# Altium schematic sheet 08) SD card.SchDoc
size 447 x 332 mm
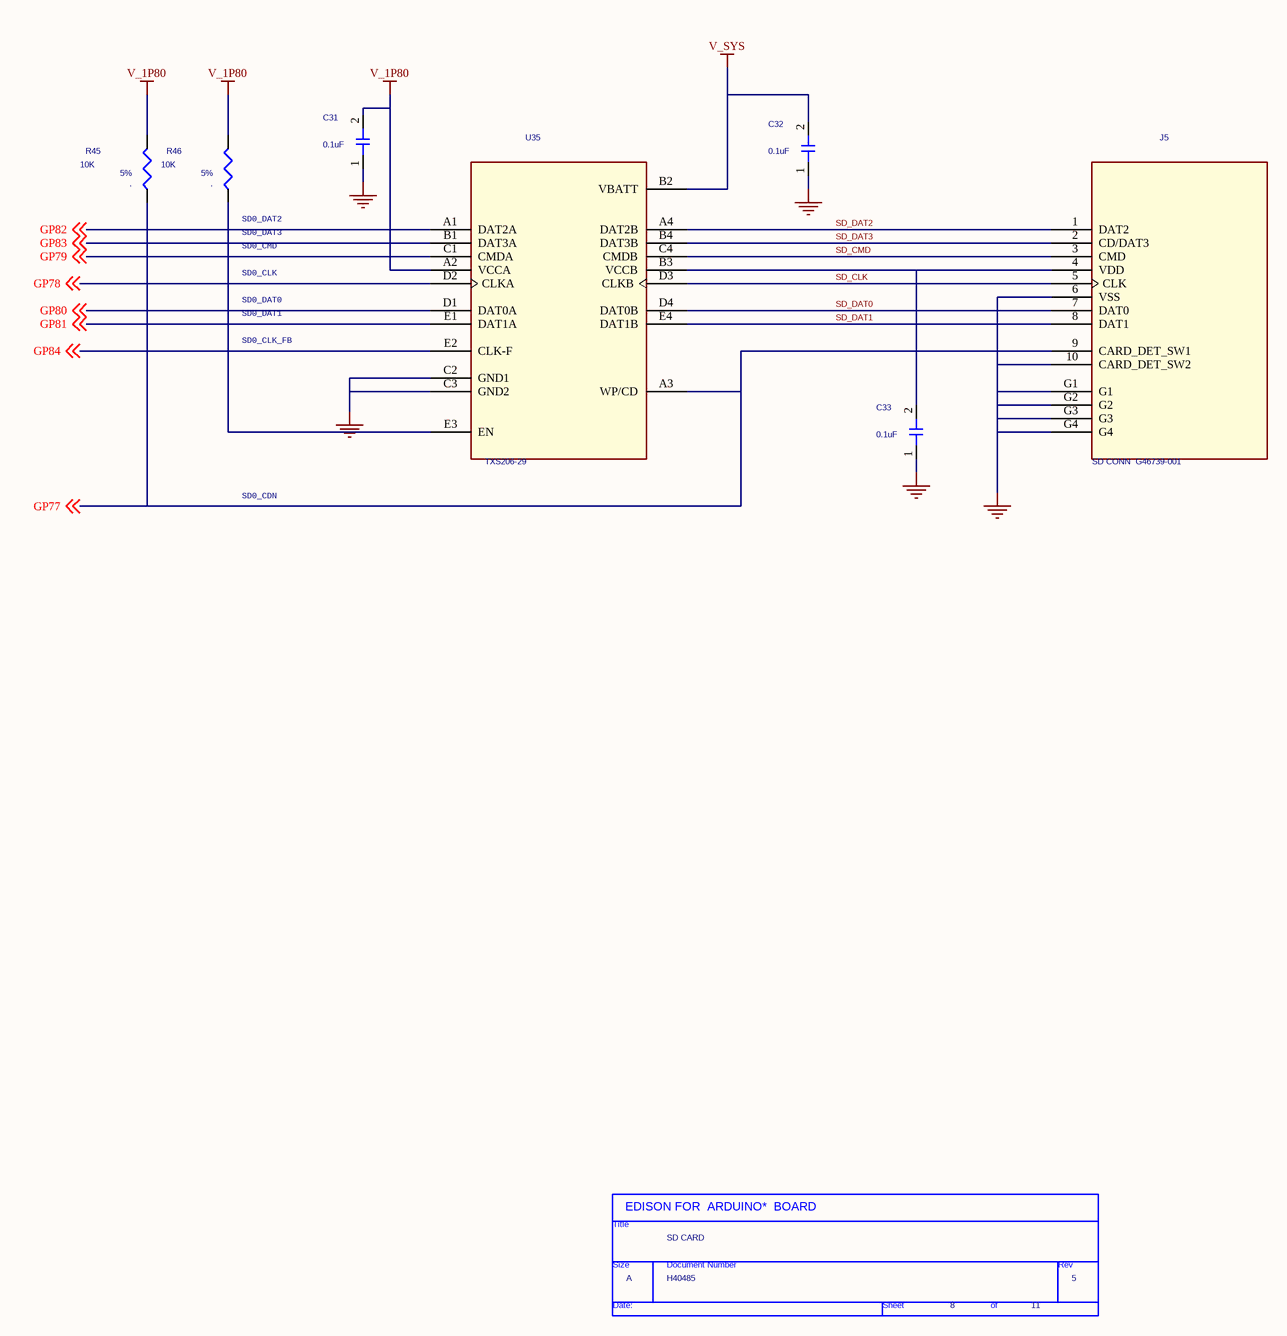
[diagram p0: 08) SD card.SchDoc]

## Parts
*  Page Count: 11  Page Number: 8  Page Size: A  Title: SD CARD  RevCode: 5  Doc: H40485  (hidden comment: TitleBlock0)  (graphical)
C31  0.1uF  [C0201]
C32  0.1uF  [C0201]
C33  0.1uF  [C0201]
J5  SD CONN  G46739-001  [1x8_p1p1mm_micro_sd]
R45  10K  NO_STUFF: .  TOL: 5%  [SMR0201]
R46  10K  NO_STUFF: .  TOL: 5%  [SMR0201]
U35  TXS206-29  [WCSP20]

## Nets
GND: C31.1(END1) C32.1(END1) C33.1(END1) J5.6(VSS) J5.10(CARD_DET_SW2) J5.G1 J5.G2 J5.G3 J5.G4 U35.C2(GND1) U35.C3(GND2)
V_1P80: C31.2(END2) R45.1 R46.1 U35.A2(VCCA)
V_SYS: C32.2(END2) U35.B2(VBATT)
GP77: J5.9(CARD_DET_SW1) R45.2 U35.A3(WP/CD) ; off-sheet GP77
GP78: U35.D2(CLKA) ; off-sheet GP78
GP79: U35.C1(CMDA) ; off-sheet GP79
GP80: U35.D1(DAT0A) ; off-sheet GP80
GP81: U35.E1(DAT1A) ; off-sheet GP81
GP82: U35.A1(DAT2A) ; off-sheet GP82
GP83: U35.B1(DAT3A) ; off-sheet GP83
GP84: U35.E2(CLK-F) ; off-sheet GP84
SD_CLK: J5.5(CLK) U35.D3(CLKB)
SD_CMD: J5.3(CMD) U35.C4(CMDB)
SD_DAT0: J5.7(DAT0) U35.D4(DAT0B)
SD_DAT1: J5.8(DAT1) U35.E4(DAT1B)
SD_DAT2: J5.1(DAT2) U35.A4(DAT2B)
SD_DAT3: J5.2(CD/DAT3) U35.B4(DAT3B)
NetC33_2: C33.2(END2) J5.4(VDD) U35.B3(VCCB)
NetR46_2: R46.2 U35.E3(EN)

## Notes on the sheet
- SD0_CMD
- (near R46) SD0_DAT2
- (near R46) SD0_DAT3
- SD0_CLK
- SD0_DAT0
- SD0_DAT1
- SD0_CLK_FB
- SD0_CDN
- (in symbol TitleBlock0) EDISON FOR  ARDUINO*  BOARD; Title; Size; Document Number; Rev; Date:; Sheet; of

## Library data of the parts
C31 = CAP: CAPC,X5R,0201,0.1UF,10.00V,+/- 10%; PART_NUMBER: C83410-014; Manufacturer: GENERIC; OriginalSymbolOrigin: (-50,50); Process: SMD; Code: 27; VOLTAGE: ?; PERC: ?; PATH: ?
C32 C33 = CAP: CAPC,X5R,0201,0.1UF,10.00V,+/- 10%; Manufacturer: GENERIC; PART_NUMBER: C83410-014; OriginalSymbolOrigin: (-50,50); Code: 27; Process: SMD; VOLTAGE: ?; PERC: ?; PATH: ?
J5 = CON8,MICROSD,NOACO_4: CONN,8-PIN,MICROSD MEM CARD,SMT,PUSH/PULL,1.42H,1040310811; NO_STUFF: .; Device: REQ3437; MFG P/N: 473092651; LEAD_FREE: YES; BOM: x; PART_NUMBER: G46739-001; IPN: G46739-001; FINANCE: x; PART NUMBER: G46739-001
R45 R46 = RESD,0201,5%,1/20W,10K: RES D,0201,10.00 kOHM,5.00%,1/20W,YES; Device: C80792-002; BOM: x; ROOM: USB; RATING: 1/20W; IPN: C80792-002; PART_NUMBER: C80792-002; LEAD_FREE: YES; FINANCE: x
U35 = TXS0206-29: IC,LOG,TRANSCEIVE,CSP,TXS0206-29,NI3S,; PART_NUMBER: H40962-001; FINANCE: x; LEAD_FREE: YES; IPN: NEW; NO_STUFF: .; MFG PN: TXS0206-29YFPR; BOM: x; Device: TXS0206
* = TitleBlock0: Page Create Date: March  8, 1995